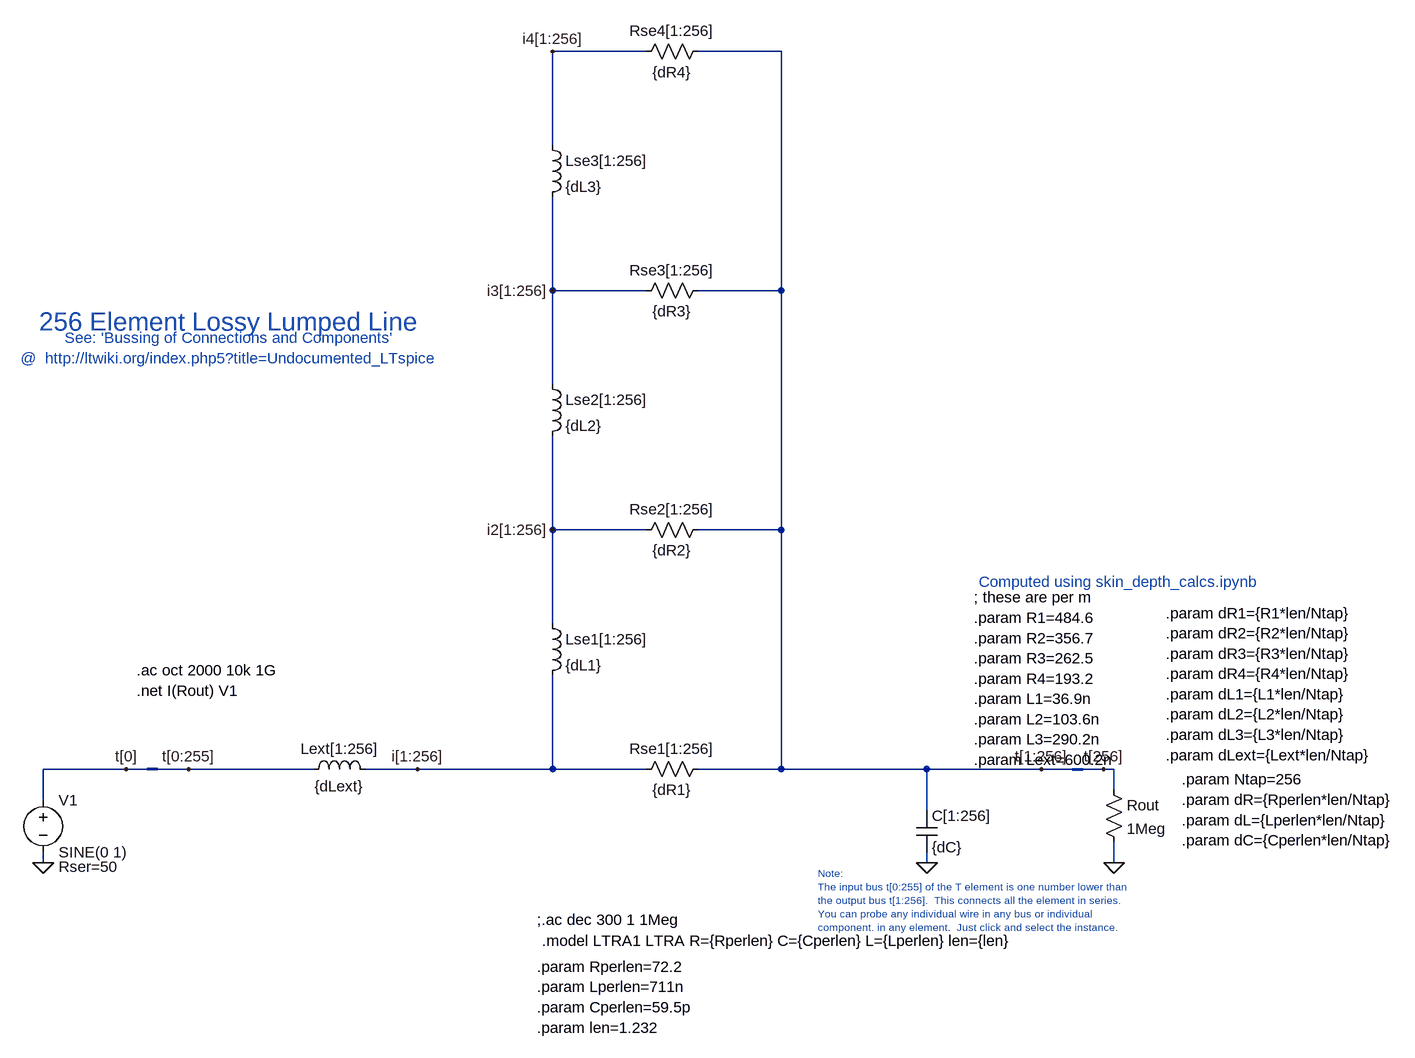
[diagram p0: schematic sparam_lumped_line_skineffect.asc]
sparam_lumped_line_skineffect.asc, the LTspice schematic file:
Version 4
SHEET 1 1668 680
WIRE 32 -1024 -112 -1024
WIRE 240 -1024 112 -1024
WIRE -112 -880 -112 -1024
WIRE -112 -656 -112 -800
WIRE 32 -656 -112 -656
WIRE 240 -656 240 -1024
WIRE 240 -656 112 -656
WIRE -112 -512 -112 -656
WIRE -112 -288 -112 -432
WIRE 32 -288 -112 -288
WIRE 240 -288 240 -656
WIRE 240 -288 112 -288
WIRE -112 -144 -112 -288
WIRE -768 80 -896 80
WIRE -736 80 -768 80
WIRE -672 80 -720 80
WIRE -480 80 -672 80
WIRE -320 80 -400 80
WIRE -112 80 -112 -64
WIRE -112 80 -320 80
WIRE 32 80 -112 80
WIRE 240 80 240 -288
WIRE 240 80 112 80
WIRE 464 80 240 80
WIRE 640 80 464 80
WIRE 688 80 640 80
WIRE 736 80 704 80
WIRE 752 80 736 80
WIRE 752 112 752 80
WIRE -896 128 -896 80
WIRE 464 144 464 80
WIRE -896 224 -896 208
WIRE 464 224 464 208
WIRE 752 224 752 192
FLAG -896 224 0
FLAG 464 224 0
FLAG -672 80 t[0:255]
FLAG 640 80 t[1:256]
FLAG -768 80 t[0]
FLAG 736 80 t[256]
FLAG 752 224 0
FLAG -320 80 i[1:256]
FLAG -112 -288 i2[1:256]
FLAG -112 -656 i3[1:256]
FLAG -112 -1024 i4[1:256]
BUSTAP -720 80 -736 80
BUSTAP 688 80 704 80
SYMBOL res 128 64 R90
WINDOW 0 0 56 VBottom 2
WINDOW 3 32 56 VTop 2
SYMATTR InstName Rse1[1:256]
SYMATTR Value {dR1}
SYMBOL cap 448 144 R0
SYMATTR InstName C[1:256]
SYMATTR Value {dC}
SYMATTR SpiceLine Rser=0
SYMBOL ind -384 96 M270
WINDOW 0 32 56 VTop 2
WINDOW 3 5 56 VBottom 2
SYMATTR InstName Lext[1:256]
SYMATTR Value {dLext}
SYMATTR SpiceLine Rser=0
SYMBOL res 736 96 R0
SYMATTR InstName Rout
SYMATTR Value 1Meg
SYMBOL voltage -896 112 R0
WINDOW 39 24 118 Left 2
SYMATTR SpiceLine Rser=50
SYMATTR InstName V1
SYMATTR Value SINE(0 1)
SYMBOL res 128 -304 R90
WINDOW 0 0 56 VBottom 2
WINDOW 3 32 56 VTop 2
SYMATTR InstName Rse2[1:256]
SYMATTR Value {dR2}
SYMBOL res 128 -672 R90
WINDOW 0 0 56 VBottom 2
WINDOW 3 32 56 VTop 2
SYMATTR InstName Rse3[1:256]
SYMATTR Value {dR3}
SYMBOL res 128 -1040 R90
WINDOW 0 0 56 VBottom 2
WINDOW 3 32 56 VTop 2
SYMATTR InstName Rse4[1:256]
SYMATTR Value {dR4}
SYMBOL ind -128 -160 R0
SYMATTR InstName Lse1[1:256]
SYMATTR Value {dL1}
SYMBOL ind -128 -528 R0
SYMATTR InstName Lse2[1:256]
SYMATTR Value {dL2}
SYMBOL ind -128 -896 R0
SYMATTR InstName Lse3[1:256]
SYMATTR Value {dL3}
TEXT -136 312 Left 2 !;.ac dec 300 1 1Meg
TEXT -608 -608 Center 4 ;256 Element Lossy Lumped Line
TEXT -608 -568 Center 2 ;See: 'Bussing of Connections and Components'\n@  http://ltwiki.org/index.php5?title=Undocumented_LTspice
TEXT 296 240 Left 1 ;Note: \nThe input bus t[0:255] of the T element is one number lower than \nthe output bus t[1:256].  This connects all the element in series.\nYou can probe any individual wire in any bus or individual \ncomponent. in any element.  Just click and select the instance.
TEXT -128 344 Left 2 !.model LTRA1 LTRA R={Rperlen} C={Cperlen} L={Lperlen} len={len}
TEXT -136 384 Left 2 !.param Rperlen=72.2\n.param Lperlen=711n\n.param Cperlen=59.5p\n.param len=1.232
TEXT 856 96 Left 2 !.param Ntap=256\n.param dR={Rperlen*len/Ntap}\n.param dL={Lperlen*len/Ntap}\n.param dC={Cperlen*len/Ntap}
TEXT -752 -72 Left 2 !.ac oct 2000 10k 1G\n.net I(Rout) V1
TEXT 832 -160 Left 2 !.param dR1={R1*len/Ntap}\n.param dR2={R2*len/Ntap}\n.param dR3={R3*len/Ntap}\n.param dR4={R4*len/Ntap}\n.param dL1={L1*len/Ntap}\n.param dL2={L2*len/Ntap}\n.param dL3={L3*len/Ntap}\n.param dLext={Lext*len/Ntap}
TEXT 536 -184 Left 2 !; these are per m\n.param R1=484.6\n.param R2=356.7\n.param R3=262.5\n.param R4=193.2\n.param L1=36.9n\n.param L2=103.6n\n.param L3=290.2n\n.param Lext=600.2n
TEXT 544 -208 Left 2 ;Computed using skin_depth_calcs.ipynb

The netlist it stands for:
* sparam_lumped_line_skineffect.asc
Rse1[1:256] t[1:256] i[1:256] {dR1}
C[1:256] t[1:256] 0 {dC} Rser=0
Lext[1:256] i[1:256] t[0:255] {dLext} Rser=0
Rout t[256] 0 1Meg
V1 t[0] 0 SINE(0 1) Rser=50
Rse2[1:256] t[1:256] i2[1:256] {dR2}
Rse3[1:256] t[1:256] i3[1:256] {dR3}
Rse4[1:256] t[1:256] i4[1:256] {dR4}
Lse1[1:256] i2[1:256] i[1:256] {dL1}
Lse2[1:256] i3[1:256] i2[1:256] {dL2}
Lse3[1:256] i4[1:256] i3[1:256] {dL3}
;.ac dec 300 1 1Meg
* 256 Element Lossy Lumped Line
* See: 'Bussing of Connections and Components'
* @  http://ltwiki.org/index.php5?title=Undocumented_LTspice
* Note:
* The input bus t[0:255] of the T element is one number lower than
* the output bus t[1:256].  This connects all the element in series.
* You can probe any individual wire in any bus or individual
* component. in any element.  Just click and select the instance.
.model LTRA1 LTRA R={Rperlen} C={Cperlen} L={Lperlen} len={len}
.param Rperlen=72.2
.param Lperlen=711n
.param Cperlen=59.5p
.param len=1.232
.param Ntap=256
.param dR={Rperlen*len/Ntap}
.param dL={Lperlen*len/Ntap}
.param dC={Cperlen*len/Ntap}
.ac oct 2000 10k 1G
.net I(Rout) V1
.param dR1={R1*len/Ntap}
.param dR2={R2*len/Ntap}
.param dR3={R3*len/Ntap}
.param dR4={R4*len/Ntap}
.param dL1={L1*len/Ntap}
.param dL2={L2*len/Ntap}
.param dL3={L3*len/Ntap}
.param dLext={Lext*len/Ntap}
; these are per m
.param R1=484.6
.param R2=356.7
.param R3=262.5
.param R4=193.2
.param L1=36.9n
.param L2=103.6n
.param L3=290.2n
.param Lext=600.2n
* Computed using skin_depth_calcs.ipynb
.backanno
.end